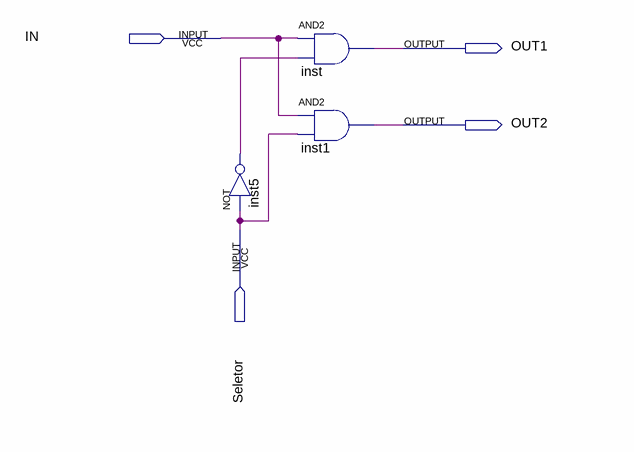
[diagram p0: schematic sheet]
// Quartus schematic DEMUX1_2.bdf as structural Verilog: 3 symbols, 4 pins
module DEMUX1_2 (
  input  IN,
  input  Seletor,
  output OUT1,
  output OUT2
);

  wire inst5_out;

  not inst5 (inst5_out, Seletor);
  and inst (OUT1, IN, inst5_out);
  and inst1 (OUT2, IN, Seletor);
endmodule
